# Altium schematic sheet SCH006.SchDoc: Digital Outputs
size A4; Date: 07-02-2024; DrawnBy: Nikhil Premjani; SheetNumber: 6; SheetTotal: 6; ModelNumber: Model Number; ModelName: Remote Manipulation Controller
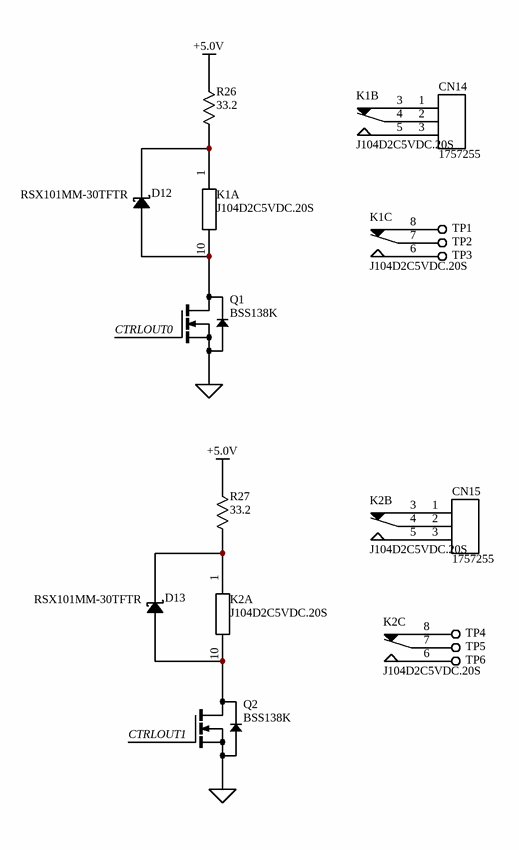
[diagram p0: SCH006.SchDoc]

## Parts
CN14  1757255  [PHOENIX_1757255]
CN15  1757255  [PHOENIX_1757255]
D12  RSX101MM-30TFTR  [SODFL350X90-2N]
D13  RSX101MM-30TFTR  [SODFL350X90-2N]
K1  J104D2C5VDC.20S  [CIT_J104D]  (parts A,B,C of 3)
K2  J104D2C5VDC.20S  [CIT_J104D]  (parts A,B,C of 3)
Q1  BSS138K  [SOT95P237X111-3N]
Q2  BSS138K  [SOT95P237X111-3N]
R26  33.2  [RESC2012X06N]
R27  33.2  [RESC2012X06N]
TP1  Test Point  [TP100]  (value not drawn)  (no BOM)
TP2  Test Point  [TP100]  (value not drawn)  (no BOM)
TP3  Test Point  [TP100]  (value not drawn)  (no BOM)
TP4  Test Point  [TP100]  (value not drawn)  (no BOM)
TP5  Test Point  [TP100]  (value not drawn)  (no BOM)
TP6  Test Point  [TP100]  (value not drawn)  (no BOM)

## Nets
+5.0V: R26.2 R27.2
GND: Q1.2(S) Q2.2(S)
CTRLOUT0: Q1.1(G)
CTRLOUT1: Q2.1(G)
NetCN14_1: CN14.1 K1.3
NetCN14_2: CN14.2 K1.4
NetCN14_3: CN14.3 K1.5
NetCN15_1: CN15.1 K2.3
NetCN15_2: CN15.2 K2.4
NetCN15_3: CN15.3 K2.5
NetD12_A: D12.A K1.10 Q1.3(D)
NetD12_K: D12.K K1.1 R26.1
NetD13_A: D13.A K2.10 Q2.3(D)
NetD13_K: D13.K K2.1 R27.1
NetK1_6: K1.6 TP3.1
NetK1_7: K1.7 TP2.1
NetK1_8: K1.8 TP1.1
NetK2_6: K2.6 TP6.1
NetK2_7: K2.7 TP5.1
NetK2_8: K2.8 TP4.1

## Notes on the sheet
- Model Number
- Model Name
- Revision
- Title
- Date
- Sheet
- of
- File
- Drawn by

## Library data of the parts
CN14 CN15 = 1757255: MSTBA 2,5/3-G-5,08 Pluggable Terminal Block 3 Pos 5.08mm pitch Through Hole Header; Manufacturer: Phoenix Contact; PartNumber: 1757255
D12 D13 = RSX101MM-30TFTR: Schottky Barrier Diode; Manufacturer: Rohm Semiconductor; PartNumber: RSX101MM-30TFTR
K1 K2 = J104D2C5VDC.20S: J104D Series Dual Form C 5V, 2A PCB Relay; Manufacturer: Circuit Interrupter Technology; PartNumber: J104D2C5VDC.20S
Q1 Q2 = BSS138K: N-Channel Logic Level Enhancement Mode Field Effect Transistor; Manufacturer: Onsemi; PartNumber: BSS138K
R26 R27 = CR0805-FX-33R2ELF: 33.2, 1%, 0.125W Thick Film Chip Resistor; Manufacturer: Bourns; PartNumber: CR0805-FX-33R2ELF
TP1-TP6 = TP3: Test Point, Surface Mount, 3 mm; Manufacturer: Confederation College; PartNumber: N/A